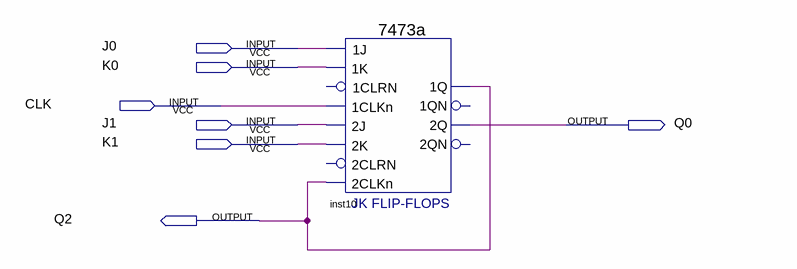
[diagram p0: schematic sheet]
// Quartus schematic cascada_JK1.bdf as structural Verilog: 1 symbols, 7 pins
module cascada_JK1 (
  input  J0,
  input  K0,
  input  CLK,
  input  J1,
  input  K1,
  output Q0,
  output Q2
);

  \7473a  inst10 (
    .\1CLKn (CLK), .\2J (J1), .\1K (K0), .\2CLKn (Q2), .\2K (K1), .\1J (J0), .\2Q (Q0), .\1Q (Q2));  // open: 1CLRN, 2CLRN, 1QN, 2QN
endmodule
